# EAGLE design Main (EAGLE 9.6.2)
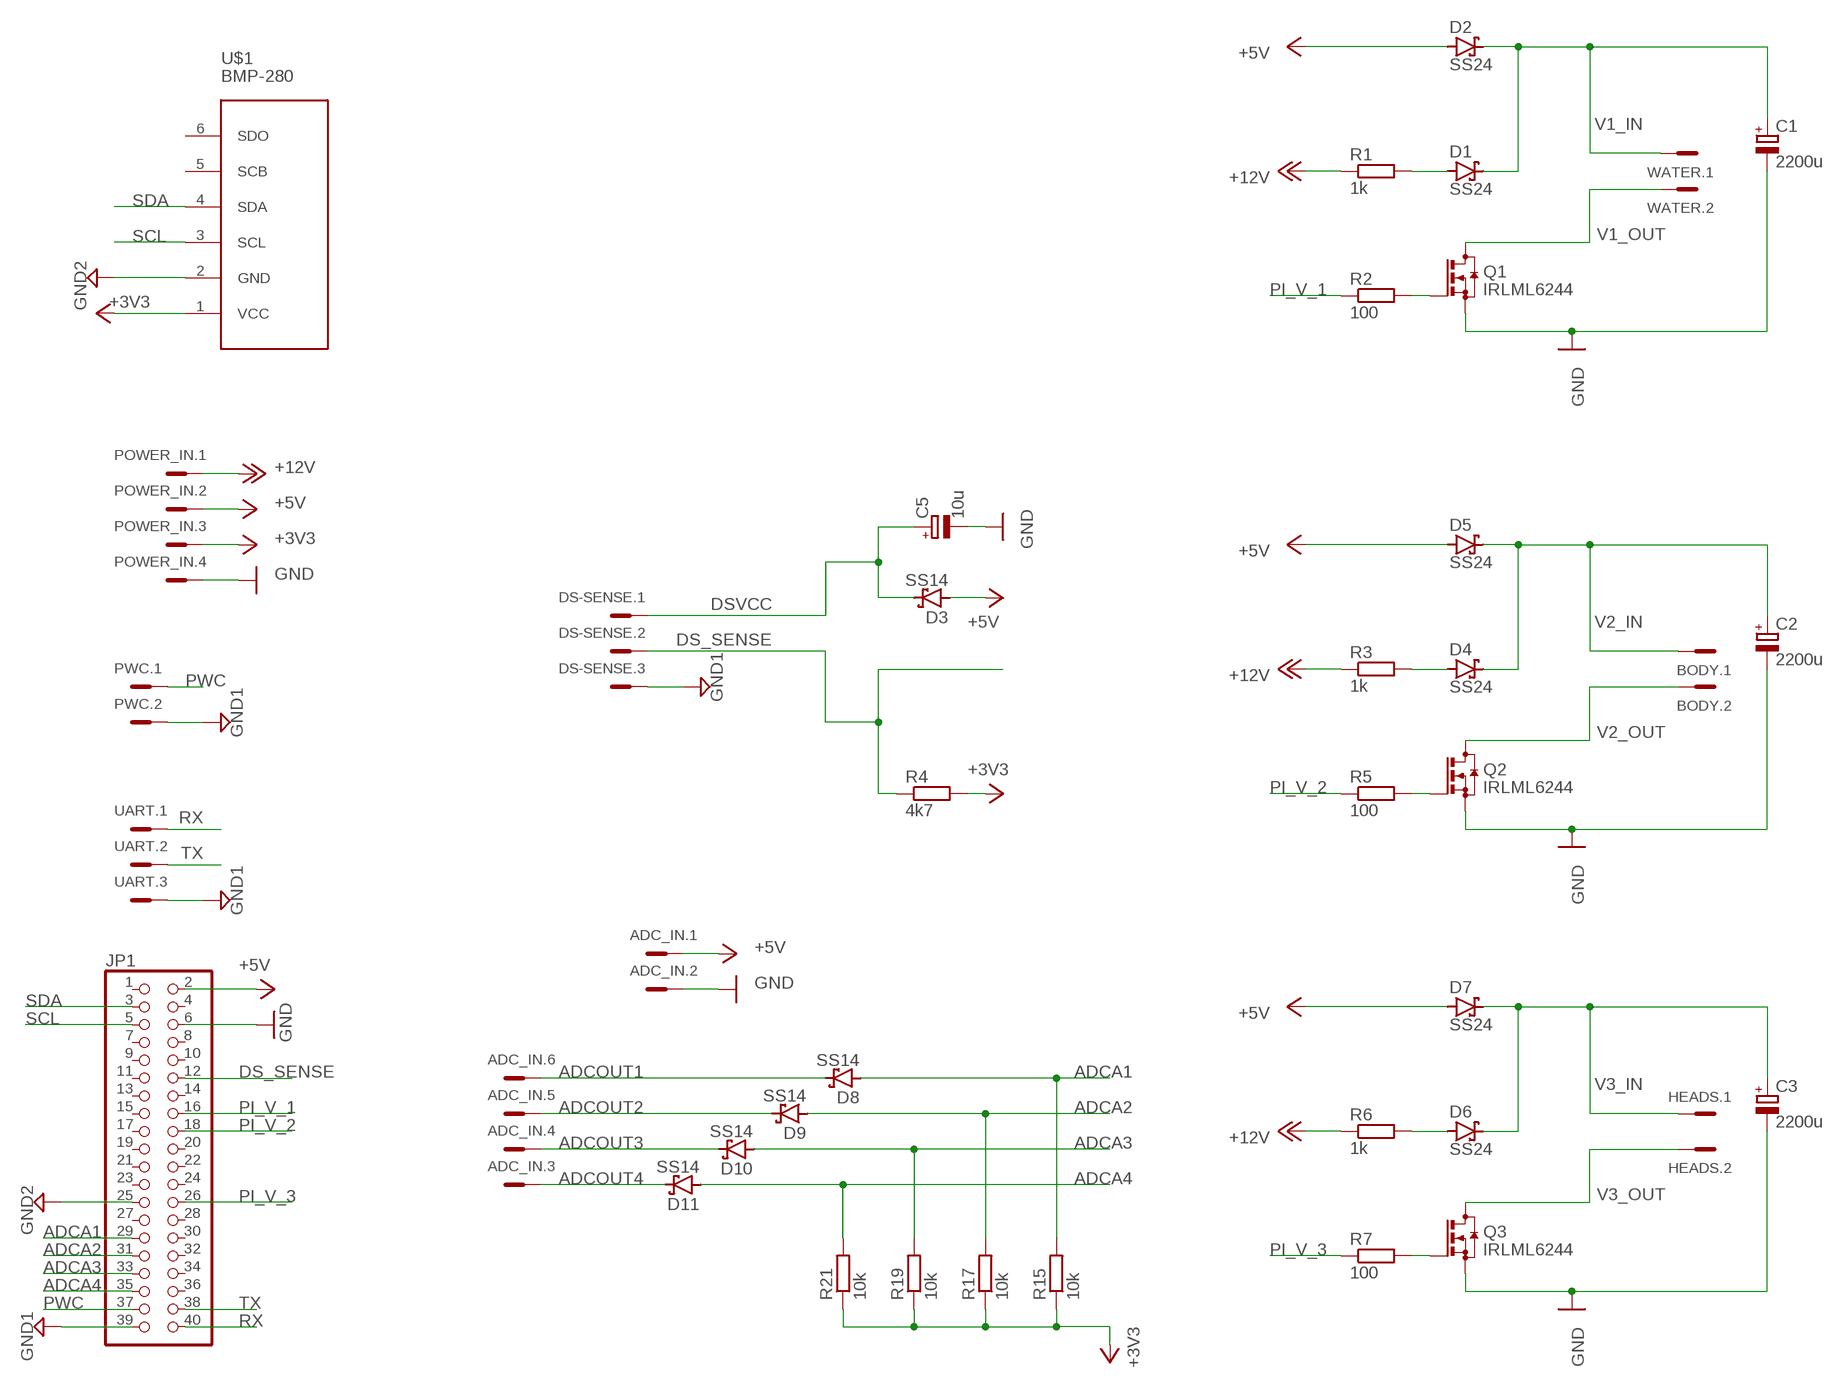
[diagram p0: schematic, sheet 1]

## Parts
ADC_IN  MCV6  [MCV6]
BODY  MCV2  [MCV2]
C1  2200u  CPOL-EUTT5D10  [TT5D10]
C2  2200u  CPOL-EUTT5D10  [TT5D10]
C3  2200u  CPOL-EUTT5D10  [TT5D10]
C5  10u  CPOL-EUSMCB  [SMC_B]
D1  SS24  SS54B  [SMB]
D2  SS24  SS54B  [SMB]
D3  SS14  SS12  [SMA]
D4  SS24  SS54B  [SMB]
D5  SS24  SS54B  [SMB]
D6  SS24  SS54B  [SMB]
D7  SS24  SS54B  [SMB]
D8  SS14  SS12  [SMA]
D9  SS14  SS12  [SMA]
D10  SS14  SS12  [SMA]
D11  SS14  SS12  [SMA]
DS-SENSE  MCV3  [MCV3]
HEADS  MCV2  [MCV2]
JP1  PINHD-2X20  [2X20]
POWER_IN  MCV4  [MCV4]
PWC  MCV2  [MCV2]
Q1  IRLML6244  BSS123  [SOT23]
Q2  IRLML6244  BSS123  [SOT23]
Q3  IRLML6244  BSS123  [SOT23]
R1  1k  R-EU_R1206  [R1206]
R2  100  R-EU_R1206  [R1206]
R3  1k  R-EU_R1206  [R1206]
R4  4k7  R-EU_R1206  [R1206]
R5  100  R-EU_R1206  [R1206]
R6  1k  R-EU_R1206  [R1206]
R7  100  R-EU_R1206  [R1206]
R15  10k  R-EU_R1206  [R1206]
R17  10k  R-EU_R1206  [R1206]
R19  10k  R-EU_R1206  [R1206]
R21  10k  R-EU_R1206  [R1206]
U$1  BMP-280  [BPM-280]
UART  MCV3  [MCV3]
WATER  MCV2  [MCV2]

## Nets
+3V3: POWER_IN.3 R4.2 R15.1 R17.1 R19.1 R21.1 U$1.1(VCC)
+5V: ADC_IN.1 D2.A D3.A D5.A D7.A JP1.2 POWER_IN.2
+12V: POWER_IN.1 R1.1 R3.1 R6.1
ADCA1: D8.A JP1.29 R15.2
ADCA2: D9.A JP1.31 R17.2
ADCA3: D10.A JP1.33 R19.2
ADCA4: D11.A JP1.35 R21.2
ADCOUT1: ADC_IN.6 D8.C
ADCOUT2: ADC_IN.5 D9.C
ADCOUT3: ADC_IN.4 D10.C
ADCOUT4: ADC_IN.3 D11.C
DS_SENSE: DS-SENSE.2 JP1.12 R4.1
DSVCC: C5.+ D3.C DS-SENSE.1
GND: ADC_IN.2 C1.- C2.- C3.- C5.- JP1.6 POWER_IN.4 Q1.2(S) Q2.2(S) Q3.2(S)
GND1: DS-SENSE.3 JP1.39 PWC.2 UART.3
GND2: JP1.25 U$1.2(GND)
N$1: D1.A R1.2
N$2: D4.A R3.2
N$3: Q1.1(G) R2.2
N$4: Q2.1(G) R5.2
N$5: D6.A R6.2
N$6: Q3.1(G) R7.2
PI_V_1: JP1.16 R2.1
PI_V_2: JP1.18 R5.1
PI_V_3: JP1.26 R7.1
PWC: JP1.37 PWC.1
RX: JP1.40 UART.1
SCL: JP1.5 U$1.3(SCL)
SDA: JP1.3 U$1.4(SDA)
TX: JP1.38 UART.2
V1_IN: C1.+ D1.C D2.C WATER.1
V1_OUT: Q1.3(D) WATER.2
V2_IN: BODY.1 C2.+ D4.C D5.C
V2_OUT: BODY.2 Q2.3(D)
V3_IN: C3.+ D6.C D7.C HEADS.1
V3_OUT: HEADS.2 Q3.3(D)
Unconnected: JP1.1 JP1.4 JP1.7 JP1.8 JP1.9 JP1.10 JP1.11 JP1.13 JP1.14 JP1.15 JP1.17 JP1.19 JP1.20 JP1.21 JP1.22 JP1.23 JP1.24 JP1.27 JP1.28 JP1.30 JP1.32 JP1.34 JP1.36 U$1.5(SCB) U$1.6(SDO)

## Library data of the parts
ADC_IN = con-phoenix-381_l:MCV6: Mini-Combicon 3.81mm vertikal 6polig MCV 1,5/6-G-3,81 Artikel-Nr. 1803468
BODY HEADS PWC WATER = con-phoenix-381_l:MCV2: Mini-Combicon 3.81mm vertikal 2polig MCV 1,5/2-G-3,81 Artikel-Nr. 1803426
C1-C3 C5 = rcl:CPOL-EU: POLARIZED CAPACITOR, European symbol; SPICEPREFIX: C
D1 D2 D4-D7 = Diodes:SS54B: SURFACE MOUNT SCHOTTKY BARRIER RECTIFIERS Manufacturer's datasheet <http://www.pdc.com.tw/product/PDF/Short%20Form/SURFACE%20MOUNT%20DEVICE/SURFACE%20MOUNT%20SCHOTTKY%20BARRIER%20RECTIFIERS/SS52B~SS510B.pdf>; CREATED_BY: PCBLayout.com; MANUFACTURER: JCET; MPN: SS54B; PACKAGE: SMB
D3 D8-D11 = Diodes:SS12: DIODE SCHOTTKY 20V 1A SMA Manufacturer's datasheet <https://www.onsemi.com/pub/Collateral/SS19-D.PDF>; CREATED_BY: PCBLayout.com; DIGIKEY_PART_NUMBER: SS12FSCT-ND; MANUFACTURER: ON Semiconductor; MPN: SS12; PACKAGE: SMA (DO-214AC)
DS-SENSE UART = con-phoenix-381_l:MCV3: Mini-Combicon 3.81mm vertikal 3polig MCV 1,5/3-G-3,81 Artikel-Nr. 1803439
JP1 = pinhead:PINHD-2X20: PIN HEADER
POWER_IN = con-phoenix-381_l:MCV4: Mini-Combicon 3.81mm vertikal 4polig MCV 1,5/4-G-3,81 Artikel-Nr. 1803442
Q1-Q3 = transistor-small-signal:BSS123: N-CHANNEL MOS FET
R1-R3 R5-R7 = resistor:R-EU_: RESISTOR, European symbol
R4 R15 R17 R19 R21 = rcl:R-EU_: RESISTOR, European symbol; SPICEPREFIX: R
U$1 = zeled:BMP-280

## Board
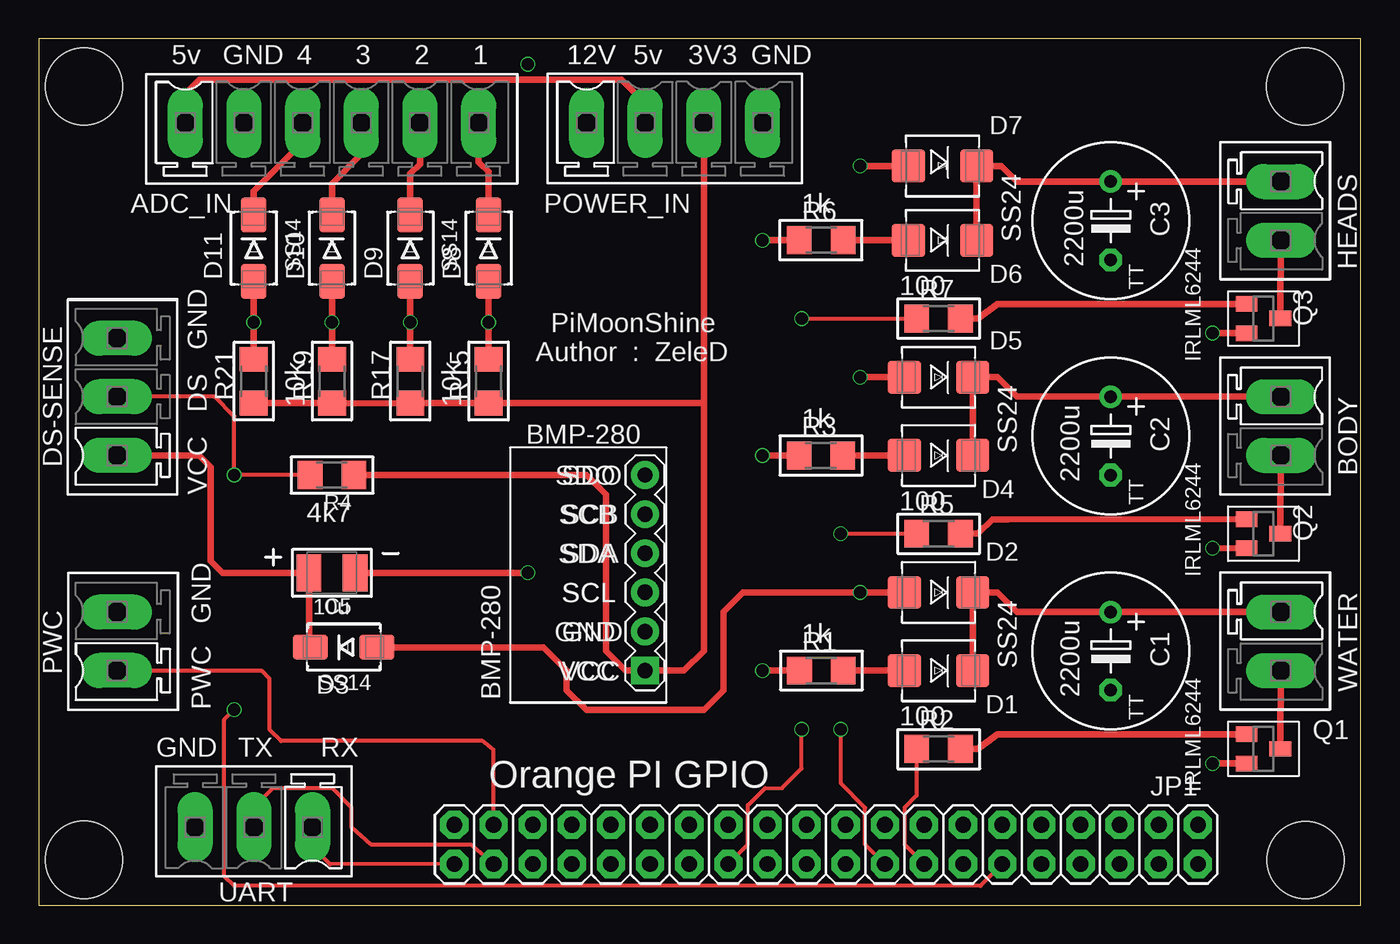
[diagram p1: board, top side]
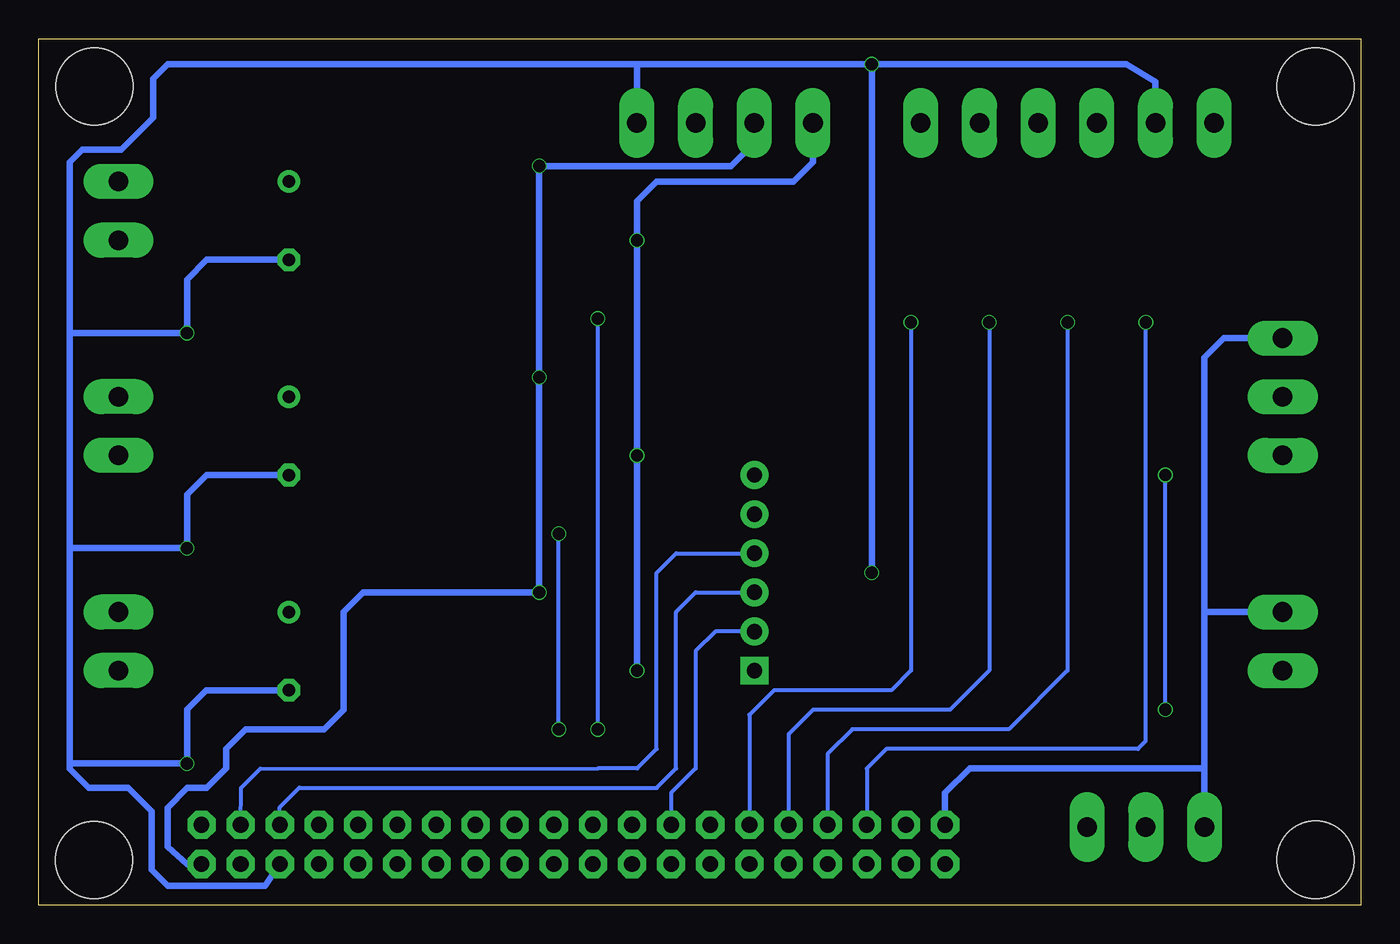
[diagram p2: board, bottom side, seen from below]

Size 85.84 x 56.28 mm. Coordinates in mm from the lower left corner, seen from the top.
Outline: 0,0 85.84,0 85.84,56.28 0,56.28 0,0
Copper layers (1*16): Top 0.035mm / dielectric 1.6mm / Bottom 0.035mm
Design rules "jlcpcp": minimum track width 5mil, minimum drill 0.3mm, track to track 5mil, track to pad 5mil, pad to pad 5mil, via to via 5mil, smd to smd 5mil, copper to edge 0.2mm, drill to drill 6mil, minimum pad ring 10mil, minimum via ring 3mil, stop-mask expansion 4mil, vias tented up to drill 0mil, thermal gap 10mil
Holes 5 mm at 2.95,53.16 2.96,2.96 82.25,2.93 82.21,53.16

### Footprints (pad centres in the part's own frame; a part is rotated, then mirrored left to right if it is on the bottom)
MCV6 = drill 1.27 pad 1.905 long: 1 -9.525,0; 2 -5.715,0; 3 -1.905,0; 4 1.905,0; 5 5.715,0; 6 9.525,0
MCV2 = drill 1.27 pad 1.905 long: 1 -1.905,0; 2 1.905,0
TT5D10 = drill 0.813: + -2.54,0 | drill 0.813 octagon: - 2.54,0
SMC_B = smd 1.6 x 2.4: + -1.5,0; - 1.5,0
SMB = smd 2.17 x 2.14: A 2.215,0; C -2.215,0
SMA = smd 2.28 x 1.66: A 2.165,0; C -2.165,0
MCV3 = drill 1.27 pad 1.905 long: 1 -3.81,0; 2 0,0; 3 3.81,0
2X20 = drill 1.016 octagon: 1 -24.13,-1.27; 2 -24.13,1.27; 3 -21.59,-1.27; 4 -21.59,1.27; 5 -19.05,-1.27; 6 -19.05,1.27; 7 -16.51,-1.27; 8 -16.51,1.27; 9 -13.97,-1.27; 10 -13.97,1.27; 11 -11.43,-1.27; 12 -11.43,1.27; 13 -8.89,-1.27; 14 -8.89,1.27; 15 -6.35,-1.27; 16 -6.35,1.27; 17 -3.81,-1.27; 18 -3.81,1.27; 19 -1.27,-1.27; 20 -1.27,1.27; 21 1.27,-1.27; 22 1.27,1.27; 23 3.81,-1.27; 24 3.81,1.27; 25 6.35,-1.27; 26 6.35,1.27; 27 8.89,-1.27; 28 8.89,1.27; 29 11.43,-1.27; 30 11.43,1.27; 31 13.97,-1.27; 32 13.97,1.27; 33 16.51,-1.27; 34 16.51,1.27; 35 19.05,-1.27; 36 19.05,1.27; 37 21.59,-1.27; 38 21.59,1.27; 39 24.13,-1.27; 40 24.13,1.27
MCV4 = drill 1.27 pad 1.905 long: 1 -5.715,0; 2 -1.905,0; 3 1.905,0; 4 5.715,0
SOT23 = smd 1 x 1.4: 1 -0.95,-1.1; 2 0.95,-1.1; 3 0,1.1
R1206 = smd 1.6 x 1.803: 1 -1.422,0; 2 1.422,0
BPM-280 = drill 1 square: 1 1.397,14.478 | drill 1: 2 1.397,11.938; 3 1.397,9.398; 4 1.397,6.858; 5 1.397,4.318; 6 1.397,1.778

### Placement (x,y rotation side)
ADC_IN  19.05,50.8 0 top
BODY  80.64,31.11 270 top
C1  69.6,16.51 270 top
C2  69.6,30.48 270 top
C3  69.6,44.45 270 top
C5  19.05,21.59 0 top
D1  58.42,15.24 180 top
D2  58.42,20.32 180 top
D3  19.81,16.76 0 top
D4  58.42,29.21 180 top
D5  58.42,34.29 180 top
D6  58.67,43.18 180 top
D7  58.67,48.01 180 top
D8  29.21,42.67 270 top
D9  24.13,42.67 270 top
D10  19.05,42.67 270 top
D11  13.97,42.67 270 top
DS-SENSE  5.08,33.02 90 top
HEADS  80.64,45.09 270 top
JP1  51.13,3.96 180 top
POWER_IN  41.29,50.8 0 top
PWC  5.08,17.14 90 top
Q1  79.5,10.16 270 top
Q2  79.5,24.13 270 top
Q3  79.5,38.1 270 top
R1  50.81,15.24 0 top
R2  58.42,10.16 0 top
R3  50.79,29.21 0 top
R4  19.05,27.94 0 top
R5  58.42,24.13 0 top
R6  50.8,43.18 0 top
R7  58.42,38.1 0 top
R15  29.21,34.04 90 top
R17  24.13,34.04 90 top
R19  19.05,34.03 90 top
R21  13.97,34.03 90 top
U$1  40.77,29.72 180 top
UART  13.97,5.08 180 top
WATER  80.64,17.14 270 top

### Tracks (layer width: path | path; a pad name or v marks a point on that pad's centre or on a via)
+3V3
  Top 0.406: POWER_IN.3 43.19,34.12 43.19,32.61 | 43.19,32.61 43.18,16.51 41.91,15.24 U$1.1 38.1,15.24 36.83,16.51 36.83,26.67 35.56,27.94 R4.2 | R21.1 R19.1 19.07,32.59 R17.1 R15.1 43.19,32.61
+5V  (via drill 0.8)
  Top 0.406: POWER_IN.2 39.37,50.81 39.37,52.07 37.85,53.59 10.41,53.59 9.53,52.7 ADC_IN.1 | D3.A 32.77,16.76 34.29,15.24 34.29,13.97 35.56,12.7 43.18,12.7 44.45,13.97 44.45,19.05 45.72,20.32 v53.34,20.32 D2.A | D7.A v53.34,48.01 | v53.34,34.29 D5.A
  Bottom 0.406: POWER_IN.2 39.37,49.53 40.89,48.01 v53.34,48.01 v53.34,34.29 v53.34,20.32 64.77,20.32 66.04,19.05 66.04,12.7 67.31,11.43 72.39,11.43 73.66,10.16 73.66,8.89 74.93,7.62 76.2,7.62 77.47,6.35 77.47,3.81 76.19,2.65 JP1.2
+12V  (via drill 0.8)
  Top 0.406: v46.99,43.18 R6.1 | v46.99,29.21 R3.1 | v46.99,15.24 R1.1
  Bottom 0.406: POWER_IN.1 35.56,48.26 36.83,46.99 45.72,46.99 46.99,45.72 v46.99,43.18 v46.99,29.21 v46.99,15.24
ADCA1  (via drill 0.8)
  Top 0.406: R15.2 v29.21,37.85 D8.A
  Bottom 0.254: v29.21,37.85 29.21,15.24 30.48,13.97 38.1,13.97 39.7,12.37 JP1.29
ADCA2  (via drill 0.8)
  Top 0.406: R17.2 v24.13,37.85 D9.A
  Bottom 0.254: v24.13,37.85 24.13,15.24 26.67,12.7 35.56,12.7 37.16,11.1 JP1.31
ADCA3  (via drill 0.8)
  Top 0.406: R19.2 v19.05,37.85 D10.A
  Bottom 0.254: v19.05,37.85 19.05,15.24 22.86,11.43 33.02,11.43 34.62,9.83 JP1.33
ADCA4  (via drill 0.8)
  Top 0.406: R21.2 v13.97,37.85 D11.A
  Bottom 0.254: JP1.35 32.08,8.89 30.81,10.16 14.48,10.16 13.97,10.67 v13.97,37.85
ADCOUT1
  Top 0.254: 28.64,48.2 28.57,48.26
  Top 0.406: D8.C 29.21,47.62 28.64,48.2 | 28.57,48.26 ADC_IN.6
ADCOUT2
  Top 0.406: ADC_IN.5 24.77,48.13 24.13,47.5 D9.C
ADCOUT3
  Top 0.406: D10.C 19.05,46.86 20.95,48.77 ADC_IN.4
ADCOUT4
  Top 0.406: ADC_IN.3 17.14,49.54 13.97,46.36 D11.C
DS_SENSE  (via drill 0.8)
  Top 0.254: JP1.12 61.14,1.27 12.7,1.27 12.06,1.91 12.06,12.06 v12.7,12.7 | R4.1 v12.7,27.94 12.7,31.75 11.43,33.02 DS-SENSE.2
  Bottom 0.254: v12.7,12.7 v12.7,27.94
DSVCC
  Top 0.406: DS-SENSE.1 10.41,29.21 11.18,28.45 11.18,22.35 11.94,21.59 C5.+ 17.55,16.86 D3.C
GND  (via drill 0.8)
  Top 0.406: Q1.2 v76.2,9.21 | Q2.2 v76.2,23.19 | Q3.2 v76.2,37.16 | C5.- v31.75,21.59
  Bottom 0.406: 83.82,37.15 83.82,48.26 83.01,49.07 80.47,49.07 78.41,51.13 78.41,53.67 77.47,54.61 46.99,54.61 | 83.82,37.15 83.82,23.2 | 83.82,23.2 83.82,9.2 | JP1.6 71.12,1.27 77.47,1.27 78.5,2.3 78.5,6.11 80.01,7.62 82.59,7.62 83.82,8.85 83.82,9.2 | 46.99,54.61 v31.75,54.61 | v31.75,54.61 15.24,54.61 13.34,53.47 ADC_IN.2 | POWER_IN.4 46.99,54.61 | C1.- 69.6,13.95 74.97,13.96 76.2,12.72 v76.2,9.21 83.81,9.21 83.82,9.2 | C2.- 74.93,27.94 76.2,26.67 v76.2,23.19 76.21,23.2 83.82,23.2 | C3.- 74.93,41.91 76.2,40.64 v76.2,37.16 83.82,37.15 | v31.75,54.61 31.75,34.29 v31.75,21.59
GND1
  Bottom 0.406: JP1.39 27,7.29 25.4,8.89 10.16,8.89 | DS-SENSE.3 8.89,36.83 10.16,35.56 10.16,19.05 | UART.3 10.16,8.89 | 10.16,8.89 10.16,19.05 | PWC.2 10.16,19.05
GND2
  Bottom 0.254: U$1.2 41.91,17.78 43.18,16.51 43.18,8.89 44.78,7.29 JP1.25
N$1
  Top 0.406: R1.2 D1.A
N$2
  Top 0.406: R3.2 D4.A
N$3
  Top 0.406: Q1.1 62.23,11.09 60.96,10.16 R2.2
N$4
  Top 0.406: Q2.1 62.91,25.07 61.9,25.07 60.96,24.13 R5.2
N$5
  Top 0.406: R6.2 D6.A
N$6
  Top 0.406: Q3.1 62.26,39.05 60.96,38.1 R7.2
PI_V_1
  Top 0.254: JP1.16 56.21,3.95 56.21,6.35 57,7.14 R2.1
PI_V_2  (via drill 0.8)
  Top 0.254: JP1.18 53.66,3.96 53.66,6.35 52.07,7.92 v52.07,11.43 | v52.07,24.13 R5.1
  Bottom 0.254: v52.07,11.43 v52.07,24.13
PI_V_3  (via drill 0.8)
  Top 0.254: JP1.26 46.05,3.96 46.05,6.5 47.16,7.61 48.26,7.62 49.53,8.89 v49.53,11.43 | v49.53,38.1 R7.1
  Bottom 0.254: v49.53,11.43 v49.53,38.1
PWC
  Top 0.254: JP1.37 29.54,10.1 28.83,10.67 15.75,10.67 14.99,11.43 14.99,14.73 14.48,15.24 PWC.1
RX
  Top 0.254: JP1.40 18.92,2.67 17.78,3.81 UART.1
SCL
  Bottom 0.254: JP1.5 70.18,6.38 68.92,7.63 45.72,7.62 44.45,8.89 44.45,19.05 43.18,20.32 U$1.3
SDA
  Bottom 0.254: JP1.3 72.69,7.62 71.45,8.88 49.53,8.89 46.99,8.89 45.72,10.16 45.72,21.59 44.45,22.86 U$1.4
TX
  Top 0.254: UART.2 13.97,6.35 15.24,7.62 19.05,7.62 20.32,6.35 20.32,5.08 21.59,3.94 28.07,3.94 JP1.38
V1_IN
  Top 0.406: WATER.1 C1.+ 63.5,19.05 62.23,20.32 D2.C D1.C
V1_OUT
  Top 0.406: WATER.2 Q1.3
V2_IN
  Top 0.406: BODY.1 C2.+ 63.5,33.02 62.23,34.29 60.71,34.29 | D5.C 60.71,34.29 | D4.C 60.63,34.22 60.71,34.29
V2_OUT
  Top 0.406: BODY.2 Q2.3
V3_IN
  Top 0.406: HEADS.1 C3.+ 63.5,46.99 62.48,48.01 D7.C D6.C
V3_OUT
  Top 0.406: HEADS.2 Q3.3

### Text on the board
tSilk: 5v | GND | 4 | 3 | 2 | 1 | 12V | 5v | 3V3 | GND | SS24 | + | SS14 | SS14 | GND | PiMoonShine / Author : ZeleD | IRLML6244 | SS24 | DS | + | VCC | SDO | SCB | SDA | IRLML6244 | SCL | SS24 | GND | + | GND | SS14 | VCC | PWC | BMP-280 | GND | TX | RX | Orange PI GPIO | IRLML6244